# EAGLE schematic teensy_pedal (EAGLE 7.3.0)

## Sheet 1 of 2
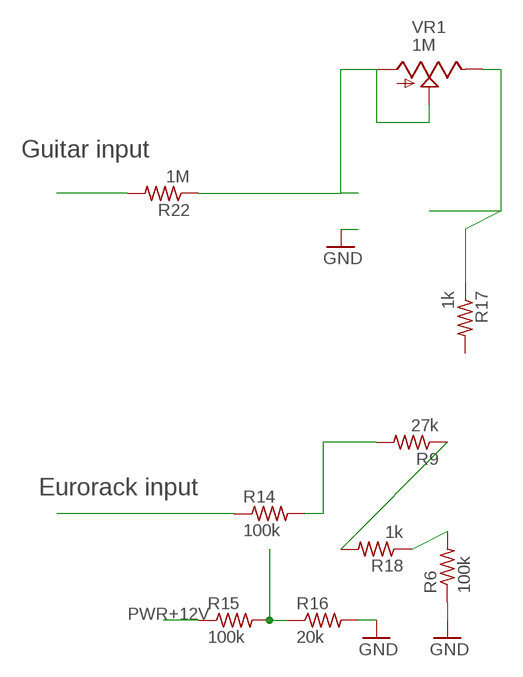
[diagram p0: schematic, sheet 1, part 1 of 3]
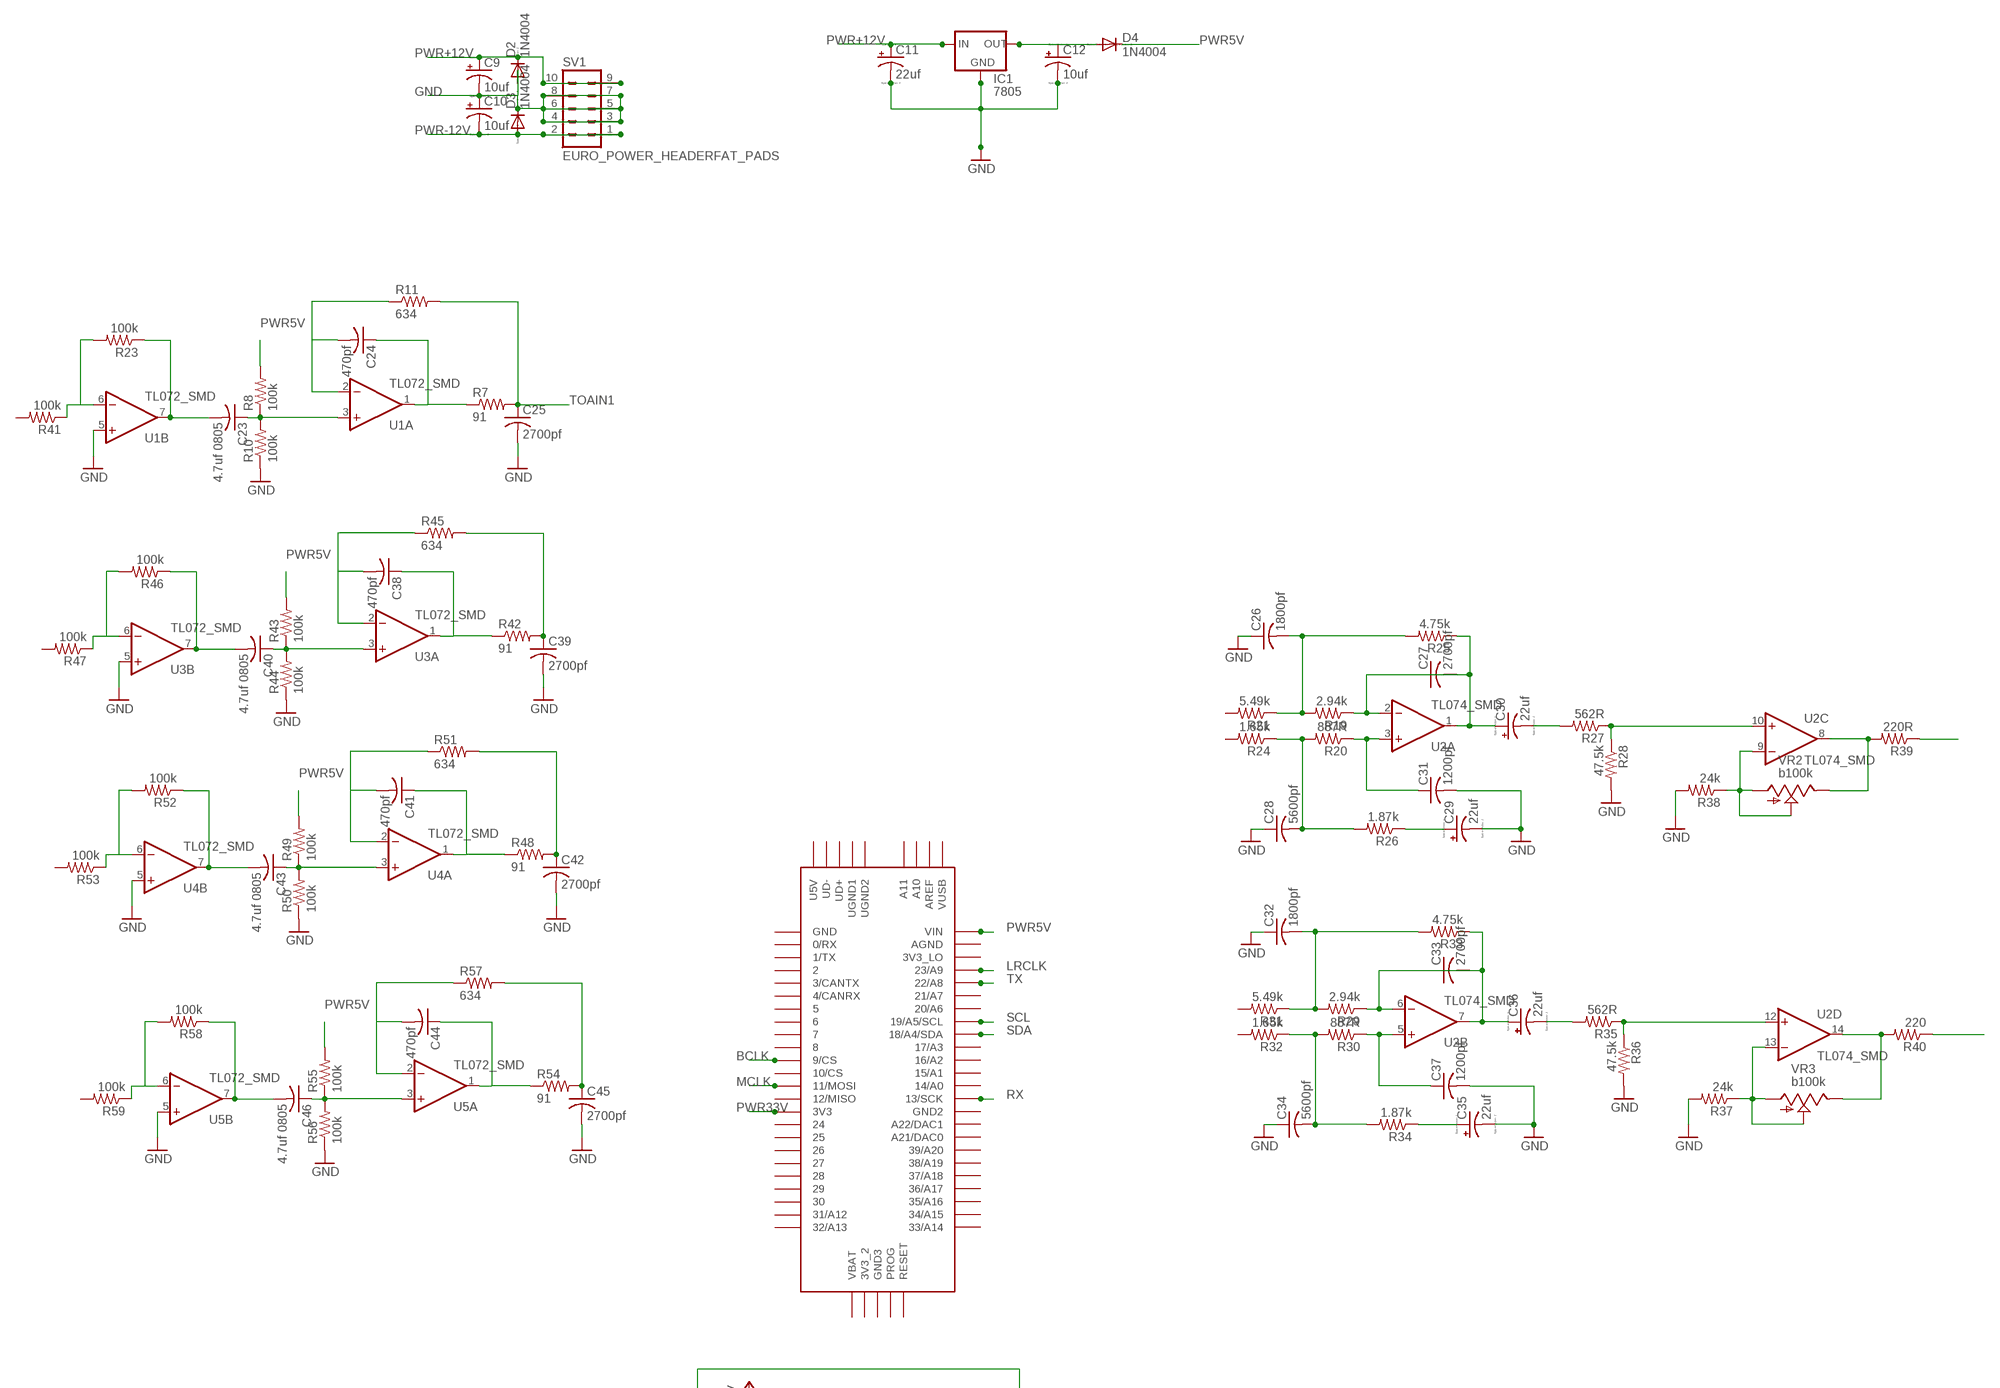
[diagram p1: schematic, sheet 1, part 2 of 3]
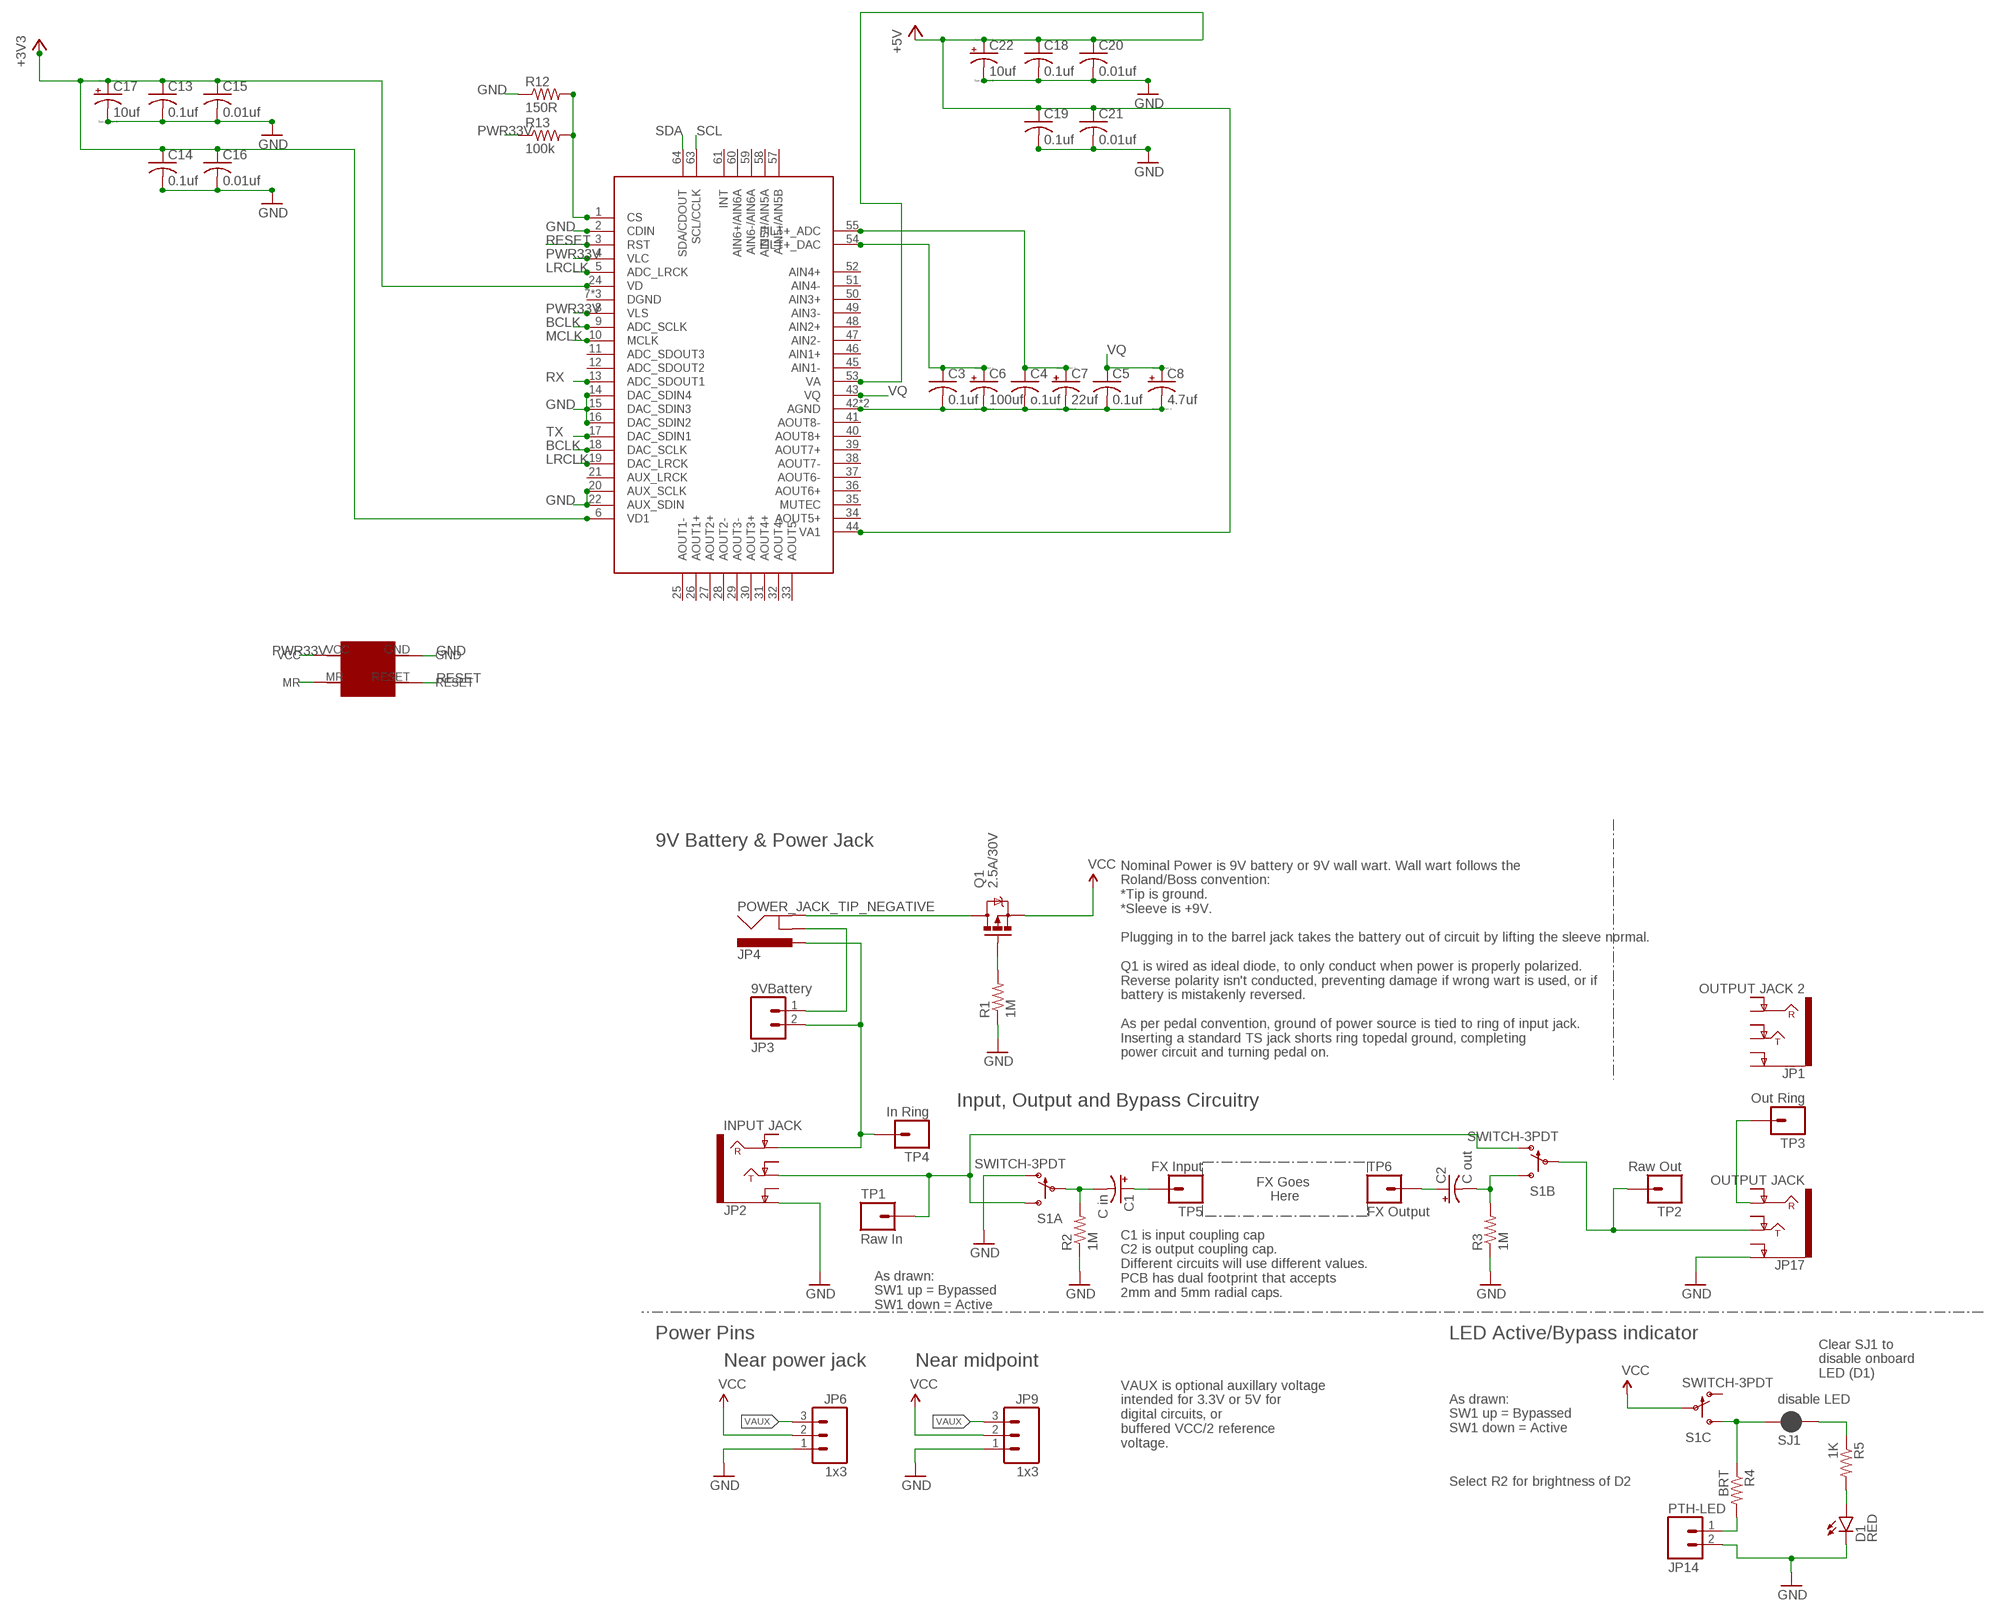
[diagram p2: schematic, sheet 1, part 3 of 3]

### Parts
C1  C in  DUAL_FOOTPRINT_CAP  [DUAL-CAP]
C2  C out  DUAL_FOOTPRINT_CAP  [DUAL-CAP]
C3  0.1uf  C-USC0603  [C0603]
C4  o.1uf  C-USC0603  [C0603]
C5  0.1uf  C-USC0603  [C0603]
C6  100uf  CPOL-US153CLV-0810  [153CLV-0810]
C7  22uf  CPOL-US153CLV-0605  [153CLV-0605]
C8  4.7uf  CPOL-US153CLV-0505  [153CLV-0505]
C9  10uf  CPOL-US153CLV-0505  [153CLV-0505]
C10  10uf  CPOL-US153CLV-0505  [153CLV-0505]
C11  22uf  CPOL-US153CLV-0605  [153CLV-0605]
C12  10uf  CPOL-US153CLV-0505  [153CLV-0505]
C13  0.1uf  C-USC0603  [C0603]
C14  0.1uf  C-USC0603  [C0603]
C15  0.01uf  C-USC0603  [C0603]
C16  0.01uf  C-USC0603  [C0603]
C17  10uf  CPOL-US153CLV-0505  [153CLV-0505]
C18  0.1uf  C-USC0603  [C0603]
C19  0.1uf  C-USC0603  [C0603]
C20  0.01uf  C-USC0603  [C0603]
C21  0.01uf  C-USC0603  [C0603]
C22  10uf  CPOL-US153CLV-0505  [153CLV-0505]
C23  4.7uf 0805  C-USC0805  [C0805]
C24  470pf  C-USC0603  [C0603]
C25  2700pf  C-USC0603  [C0603]
C26  1800pf  C-USC0603  [C0603]
C27  2700pf  C-USC0603  [C0603]
C28  5600pf  C-USC0603  [C0603]
C29  22uf  CPOL-US153CLV-0605  [153CLV-0605]
C30  22uf  CPOL-US153CLV-0605  [153CLV-0605]
C31  1200pf  C-USC0603  [C0603]
C32  1800pf  C-USC0603  [C0603]
C33  2700pf  C-USC0603  [C0603]
C34  5600pf  C-USC0603  [C0603]
C35  22uf  CPOL-US153CLV-0605  [153CLV-0605]
C36  22uf  CPOL-US153CLV-0605  [153CLV-0605]
C37  1200pf  C-USC0603  [C0603]
C38  470pf  C-USC0603  [C0603]
C39  2700pf  C-USC0603  [C0603]
C40  4.7uf 0805  C-USC0805  [C0805]
C41  470pf  C-USC0603  [C0603]
C42  2700pf  C-USC0603  [C0603]
C43  4.7uf 0805  C-USC0805  [C0805]
C44  470pf  C-USC0603  [C0603]
C45  2700pf  C-USC0603  [C0603]
C46  4.7uf 0805  C-USC0805  [C0805]
D1  RED  LED-RED0603  [LED-0603]
D2  1N4004  [DO41-10]
D3  1N4004  [DO41-10]
D4  1N4004  [DO41-10]
IC1  7805  78XXS  [78XXS]
JP1  OUTPUT JACK 2  AUDIO-JACK4-.25-HORIZ-TRS  [AUDIO-JACK-.25-INCH-HORIZ-PTH]
JP2  INPUT JACK  AUDIO-JACK4-.25-HORIZ-TRS  [AUDIO-JACK-.25-INCH-HORIZ-PTH]
JP3  9VBattery  M02PTH3  [1X02_LONGPADS]
JP4  POWER_JACK_TIP_NEGATIVE  [POWER-BARRELJACK-PTH-LOCK-FIXED]
JP6  1x3  M031X03_NO_SILK  [1X03_NO_SILK]
JP9  1x3  M031X03_NO_SILK  [1X03_NO_SILK]
JP14  PTH-LED  M02PTH3  [1X02_LONGPADS]
JP17  OUTPUT JACK  AUDIO-JACK4-.25-HORIZ-TRS  [AUDIO-JACK-.25-INCH-HORIZ-PTH]
Q1  2.5A/30V  MOSFET-PCHANNELDMG2307L  [SOT23-3]
R1  1M  1MOHM-1/10W-1%(0603)  [0603-RES]
R2  1M  1MOHM-1/10W-1%(0603)  [0603-RES]
R3  1M  1MOHM-1/10W-1%(0603)  [0603-RES]
R4  BRT  RESISTORAXIAL-0.3  [AXIAL-0.3]
R5  1K  1KOHM-1/10W-1%(0603)  [0603-RES]
R6  100k  R-US_R0603  [R0603]
R7  91  R-US_R0603  [R0603]
R8  100k  R-US_R0603  [R0603]
R9  27k  R-US_R0603  [R0603]
R10  100k  R-US_R0603  [R0603]
R11  634  R-US_R0603  [R0603]
R12  150R  R-US_R0603  [R0603]
R13  100k  R-US_R0603  [R0603]
R14  100k  R-US_R0603  [R0603]
R15  100k  R-US_R0603  [R0603]
R16  20k  R-US_R0603  [R0603]
R17  1k  R-US_R0603  [R0603]
R18  1k  R-US_R0603  [R0603]
R19  2.94k  R-US_R0603  [R0603]
R20  887R  R-US_R0603  [R0603]
R21  5.49k  R-US_R0603  [R0603]
R22  1M  R-US_R0603  [R0603]
R23  100k  R-US_R0603  [R0603]
R24  1.65k  R-US_R0603  [R0603]
R25  4.75k  R-US_R0603  [R0603]
R26  1.87k  R-US_R0603  [R0603]
R27  562R  R-US_R0603  [R0603]
R28  47.5k  R-US_R0603  [R0603]
R29  2.94k  R-US_R0603  [R0603]
R30  887R  R-US_R0603  [R0603]
R31  5.49k  R-US_R0603  [R0603]
R32  1.65k  R-US_R0603  [R0603]
R33  4.75k  R-US_R0603  [R0603]
R34  1.87k  R-US_R0603  [R0603]
R35  562R  R-US_R0603  [R0603]
R36  47.5k  R-US_R0603  [R0603]
R37  24k  R-US_R0603  [R0603]
R38  24k  R-US_R0603  [R0603]
R39  220R  R-US_R0603  [R0603]
R40  220  R-US_R0603  [R0603]
R41  100k  R-US_R0603  [R0603]
R42  91  R-US_R0603  [R0603]
R43  100k  R-US_R0603  [R0603]
R44  100k  R-US_R0603  [R0603]
R45  634  R-US_R0603  [R0603]
R46  100k  R-US_R0603  [R0603]
R47  100k  R-US_R0603  [R0603]
R48  91  R-US_R0603  [R0603]
R49  100k  R-US_R0603  [R0603]
R50  100k  R-US_R0603  [R0603]
R51  634  R-US_R0603  [R0603]
R52  100k  R-US_R0603  [R0603]
R53  100k  R-US_R0603  [R0603]
R54  91  R-US_R0603  [R0603]
R55  100k  R-US_R0603  [R0603]
R56  100k  R-US_R0603  [R0603]
R57  634  R-US_R0603  [R0603]
R58  100k  R-US_R0603  [R0603]
R59  100k  R-US_R0603  [R0603]
S1  SWITCH-3PDT  [STOMP-SWITCH-3PDT]
SJ1  disable LED  JUMPER-PAD-2-NC_BY_PASTEFULL-BOX-SILK  [PAD-JUMPER-2-NC_BY_PASTE_YES_SILK_FULL_BOX]
SV1  EURO_POWER_HEADERFAT_PADS  [EURO_PWR_HEADER_FAT]
TP1  Raw In  M01PTH_NO_SILK_YES_STOP  [1X01_NO_SILK]
TP2  Raw Out  M01PTH_NO_SILK_YES_STOP  [1X01_NO_SILK]
TP3  Out Ring  M01PTH_NO_SILK_YES_STOP  [1X01_NO_SILK]
TP4  In Ring  M01PTH_NO_SILK_YES_STOP  [1X01_NO_SILK]
TP5  FX Input  M01PTH_NO_SILK_YES_STOP  [1X01_NO_SILK]
TP6  FX Output  M01PTH_NO_SILK_YES_STOP  [1X01_NO_SILK]
U1  TL072_SMD  [SO08]
U2  TL074_SMD  [SO14]
U3  TL072_SMD  [SO08]
U4  TL072_SMD  [SO08]
U5  TL072_SMD  [SO08]
U$1  CS42448  [LQFP64]
U$2  TEENSY_3.5/3.6  [TEENSY_3.5/3.6]
U$3  CAT811  [SOT-143]
VR1  1M  9MM_SNAP-IN_POT_  [9MM_SNAP-IN_POT]
VR2  b100k  9MM_SNAP-IN_POT_  [9MM_SNAP-IN_POT]
VR3  b100k  9MM_SNAP-IN_POT_  [9MM_SNAP-IN_POT]

### Nets
BCLK: U$1.9(ADC_SCLK) U$1.18(DAC_SCLK) U$2.9/CS
FX_IN: C1.P$2(-) C1.P$3(-) R2.2 S1.P$2(A:P)
FX_OUT: C2.P$2(-) C2.P$3(-) R3.2 S1.P$6(B:S)
GND: C9.- C10.+ C11.- C12.- C13.2 C14.2 C15.2 C16.2 C17.- C18.2 C19.2 C20.2 C21.2 C22.- C25.2 C26.1 C28.1 C29.- C31.2 C32.1 C34.1 C35.- C37.2 C39.2 C42.2 C45.2 D1.C D2.A D3.C IC1.GND JP2.SLEEVE(EARTH) JP6.1 JP9.1 JP14.2 JP17.SLEEVE(EARTH) R1.1 R2.1 R3.1 R6.1 R10.1 R12.1 R16.2 R28.2 R36.2 R37.2 R38.2 R44.1 R50.1 R56.1 S1.P$1(A:O) SV1.3 SV1.4 SV1.5 SV1.6 SV1.7 SV1.8 U1.5(B:+IN) U3.5(B:+IN) U4.5(B:+IN) U5.5(B:+IN) U$1.2(CDIN) U$1.14(DAC_SDIN4) U$1.15(DAC_SDIN3) U$1.16(DAC_SDIN2) U$1.20(AUX_SCLK) U$1.22(AUX_SDIN)
LEDA: JP14.1 R4.P$2
LRCLK: U$1.5(ADC_LRCK) U$1.19(DAC_LRCK) U$2.23/A9
MCLK: U$1.10(MCLK) U$2.11/MOSI
N$1: R12.2 R13.2 U$1.1(CS)
N$2: C3.2 C4.2 C5.2 C6.- C7.- C8.- U$1.42(AGND) U$1.56(AGND)
N$4: C4.1 C7.+ U$1.55(FILT+_ADC)
N$5: C3.1 C6.+ U$1.54(FILT+_DAC)
N$6: C24.1 R7.1 U1.1(A:OUT)
N$7: R17.1 VR1.3(E)
N$8: C12.+ D4.A IC1.OUT
N$9: C24.2 R11.1 U1.2(A:-IN)
N$10: C23.1 R8.1 R10.2 U1.3(A:+IN)
N$11: R37.1 U2.13(D:-IN) VR3.1(A) VR3.2(S)
N$12: R15.2 R16.1
N$13: R9.1 R18.2
N$14: R9.2 R14.2
N$15: R14.1
N$16: C30.- R27.2
N$17: R27.1 R28.1 U2.10(C:+IN)
N$18: C31.1 R20.1 U2.3(A:+IN)
N$19: R22.1 VR1.1(A) VR1.2(S)
N$20: C23.2 R23.1 U1.7(B:OUT)
N$21: R6.2 R18.1
N$22: R22.2
N$23: C27.1 C27.2 C30.+ R19.1 R25.1 U2.1(A:OUT) U2.2(A:-IN)
N$24: R38.1 U2.9(C:-IN) VR2.1(A) VR2.2(S)
N$25: D1.A R5.2
N$26: C28.2 R20.2 R24.1 R26.2
N$27: R40.2 U2.14(D:OUT) VR3.3(E)
N$28: C29.+ R26.1
N$29: R39.2 U2.8(C:OUT) VR2.3(E)
N$30: R39.1
N$31: C26.2 R19.2 R21.1 R25.2
N$32: C36.- R35.2
N$33: R35.1 R36.1 U2.12(D:+IN)
N$34: C37.1 R30.1 U2.5(B:+IN)
N$35: R4.P$1 S1.P$9(C:S) SJ1.1
N$36: C33.1 C33.2 C36.+ R29.1 R33.1 U2.6(B:-IN) U2.7(B:OUT)
N$37: C34.2 R30.2 R32.1 R34.2
N$38: C35.+ R34.1
N$39: C32.2 R29.2 R31.1 R33.2
N$40: R40.1
N$41: R23.2 R41.1 U1.6(B:-IN)
N$42: C38.1 R42.1 U3.1(A:OUT)
N$43: C38.2 R45.1 U3.2(A:-IN)
N$44: C40.1 R43.1 R44.2 U3.3(A:+IN)
N$45: JP3.1 JP4.SLEEVE-NORMAL(SLEEVEBREAK)
N$46: C40.2 R46.1 U3.7(B:OUT)
N$47: R46.2 R47.1 U3.6(B:-IN)
N$48: C41.1 R48.1 U4.1(A:OUT)
N$49: C41.2 R51.1 U4.2(A:-IN)
N$50: C43.1 R49.1 R50.2 U4.3(A:+IN)
N$51: C43.2 R52.1 U4.7(B:OUT)
N$52: R52.2 R53.1 U4.6(B:-IN)
N$53: C44.1 R54.1 U5.1(A:OUT)
N$54: C44.2 R57.1 U5.2(A:-IN)
N$55: JP2.RING JP3.2 JP4.TIP TP4.1
N$56: C46.1 R55.1 R56.2 U5.3(A:+IN)
N$57: C46.2 R58.1 U5.7(B:OUT)
N$58: R58.2 R59.1 U5.6(B:-IN)
N$65: R5.1 SJ1.2
N$66: JP17.RING TP3.1
N$67: C1.P$1(+) TP5.1
N$68: C2.P$1(+) TP6.1
N$70: JP2.TIP S1.P$3(A:S) S1.P$4(B:O) TP1.1
N$71: JP17.TIP S1.P$5(B:P) TP2.1
N$75: Q1.1(G) R1.2
PWR5V: C18.1 C19.1 C20.1 C21.1 C22.+ D4.C R8.2 R43.2 R49.2 R55.2 U$1.44(VA1) U$1.53(VA) U$2.VIN ; supply symbol labelled +5V
PWR33V: C13.1 C14.1 C15.1 C16.1 C17.+ R13.1 U$1.4(VLC) U$1.6(VD1) U$1.8(VLS) U$1.24(VD) U$2.3V3 ; supply symbol labelled +3V3
PWR+12V: C9.+ C11.+ D2.C IC1.IN R15.1 SV1.9 SV1.10
PWR-12V: C10.- D3.A SV1.1 SV1.2
RESET: U$1.3(RST)
RX: U$1.13(ADC_SDOUT1) U$2.13/SCK
SCL: U$1.63(SCL/CCLK) U$2.19/A5/SCL
SDA: U$1.64(SDA/CDOUT) U$2.18/A4/SDA
TOAIN1: C25.1 C42.1 R7.2 R11.2 R48.2 R51.2
TOAIN2: C39.1 R42.2 R45.2
TOAIN3: C45.1 R54.2 R57.2
TX: U$1.17(DAC_SDIN1) U$2.22/A8
VAUX: JP6.3 JP9.3
VBATT: JP4.SLEEVE Q1.3(D)
VCC: JP6.2 JP9.2 Q1.2(S) S1.P$8(C:P)
VQ: C5.1 C8.+ U$1.43(VQ)
Unconnected: JP1.RING JP1.RING-NORM JP1.SLEEVE(EARTH) JP1.SLEEVE-NORM(EARTH-NORM) JP1.TIP JP1.TIP-NORM JP2.RING-NORM JP2.SLEEVE-NORM(EARTH-NORM) JP2.TIP-NORM JP17.RING-NORM JP17.SLEEVE-NORM(EARTH-NORM) JP17.TIP-NORM R17.2 R21.2 R24.2 R31.2 R32.2 R41.2 R47.2 R53.2 R59.2 S1.P$7(C:O) U$1.11(ADC_SDOUT3) U$1.12(ADC_SDOUT2) U$1.21(AUX_LRCK) U$1.25(AOUT1-) U$1.26(AOUT1+) U$1.27(AOUT2+) U$1.28(AOUT2-) U$1.29(AOUT3-) U$1.30(AOUT3+) U$1.31(AOUT4+) U$1.32(AOUT4-) U$1.33(AOUT5-) U$1.34(AOUT5+) U$1.35(MUTEC) U$1.36(AOUT6+) U$1.37(AOUT6-) U$1.38(AOUT7-) U$1.39(AOUT7+) U$1.40(AOUT8+) U$1.41(AOUT8-) U$1.45(AIN1-) U$1.46(AIN1+) U$1.47(AIN2-) U$1.48(AIN2+) U$1.49(AIN3-) U$1.50(AIN3+) U$1.51(AIN4-) U$1.52(AIN4+) U$1.57(AIN5-/AIN5B) U$1.58(AIN5+/AIN5A) U$1.59(AIN6-/AIN6A) U$1.60(AIN6+/AIN6A) U$1.61(INT) U$2.0/RX U$2.1/TX U$2.2 U$2.3/CANTX U$2.3V3_2 U$2.3V3_LO U$2.4/CANRX U$2.5 U$2.6 U$2.7 U$2.8 U$2.10/CS U$2.12/MISO U$2.14/A0 U$2.15/A1 U$2.16/A2 U$2.17/A3 U$2.20/A6 U$2.21/A7 U$2.21/DAC0(A21/DAC0) U$2.24 U$2.25 U$2.26 U$2.27 U$2.28 U$2.29 U$2.30 U$2.31/A12 U$2.32/A13 U$2.33/A14 U$2.34/A15 U$2.35/A16 U$2.36/A17 U$2.37/A18 U$2.38/A19 U$2.39/A20 U$2.A10 U$2.A11 U$2.A22/DAC1 U$2.AGND U$2.AREF U$2.GND U$2.GND2 U$2.GND3 U$2.PROG U$2.RESET U$2.U5V U$2.UD+ U$2.UD- U$2.UGND1 U$2.UGND2 U$2.VBAT U$2.VUSB U$3.GND U$3.MR U$3.RESET U$3.VCC

### Notes on the sheet
- Guitar input
- Eurorack input
- 9V Battery & Power Jack
- Nominal Power is 9V battery or 9V wall wart. Wall wart follows the 
  Roland/Boss convention:
  *Tip is ground.
  *Sleeve is +9V.
  
  Plugging in to the barrel jack takes the battery out of circuit by lifting the sleeve normal.
  
  Q1 is wired as ideal diode, to only conduct when power is properly polarized.  
  Reverse polarity isn't conducted, preventing damage if wrong wart is used, or if 
  battery is mistakenly reversed.
  
  As per pedal convention, ground of power source is tied to ring of input jack.  
  Inserting a standard TS jack shorts ring topedal ground, completing 
  power circuit and turning pedal on.
- Input, Output and Bypass Circuitry
- FX Goes 
  Here
- C1 is input coupling cap
  C2 is output coupling cap.
  Different circuits will use different values.
  PCB has dual footprint that accepts 
  2mm and 5mm radial caps.
- As drawn:
  SW1 up = Bypassed
  SW1 down = Active
- Power Pins | LED Active/Bypass indicator
- Clear SJ1 to 
  disable onboard 
  LED (D1)
- Near power jack | Near midpoint
- VAUX is optional auxillary voltage
  intended for 3.3V or 5V for 
  digital circuits, or 
  buffered VCC/2 reference 
  voltage.
- As drawn:
  SW1 up = Bypassed
  SW1 down = Active
- Select R2 for brightness of D2

## Sheet 2 of 2

## Power pins joined to a net without a drawn wire
DGND: U$1.7(DGND) U$1.23(DGND) U$1.62(DGND)
V+: U1.8(P:V+) U2.4(P:V+) U3.8(P:V+) U4.8(P:V+) U5.8(P:V+)
V-: U1.4(P:V-) U2.11(P:V-) U3.4(P:V-) U4.4(P:V-) U5.4(P:V-)

## Library data of the parts
C1 C2 = Testing:DUAL_FOOTPRINT_CAP: Dual-footprint capacitor. Allows for population of PTH caps with 2mm or 5mm lead spacing. For times when you know you might need a coupling or bypass cap, but need flexibility for larger/smaller values.
C3-C5 C13-C16 C18-C21 C23-C28 C31-C34 C37-C46 = resistor:C-US: CAPACITOR, American symbol
C6-C12 C17 C22 C29 C30 C35 C36 = resistor:CPOL-US: POLARIZED CAPACITOR, American symbol
D1 = SparkFun-LED:LED-RED: Assorted Red LEDs LilyPad 1206- DIO-09912 1206- DIO-00809 0603- DIO-00819 "SMART" means more efficient and expensive; PROD_ID: DIO-00819
D2-D4 = diode:1N4004: DIODE general purpose rectifier, 1 A
IC1 = v-reg:78XXS: VOLTAGE REGULATOR
JP1 JP2 JP17 = SparkFun-Connectors:AUDIO-JACK4-.25-HORIZ-TRS: 1/4" TRS jack, horizontal Production SKU: COM-11144 Footprint unproven - datasheet and part seem to be slightly different; PROD_ID: CONN-12339; SF_ID: COM-11144
JP3 JP14 = SparkFun-Connectors:M02: Standard 2-pin 0.1" header. Use with - straight break away headers ( PRT-00116) - right angle break away headers (PRT-00553) - swiss pins (PRT-00743) - machine pins (PRT-00117) - female headers (PRT-00115) Molex polarized connector foot print use with: PRT-08233 with associated crimp pins and housings. 2.54_SCREWTERM for use with PRT-10571. 3.5mm Screw Terminal footprints for PRT-08084 5mm Screw Terminal footprints for use with PRT-08432
JP4 = Testing:POWER_JACK_TIP_NEGATIVE; PROD_ID: CONN-08197
JP6 JP9 = SparkFun-Connectors:M03: Header 3 Standard 3-pin 0.1" header. Use with straight break away headers (SKU : PRT-00116), right angle break away headers (PRT-00553), swiss pins (PRT-00743), machine pins (PRT-00117), and female headers (PRT-00115). Molex polarized connector foot print use with SKU : PRT-08232 with associated crimp pins and housings.
Q1 = SparkFun-DiscreteSemi:MOSFET-PCHANNEL: Generic PMOSFET IRLML2244 - TRANS-11153 (SOT-23 -20V -4.3A) (1.Gate 2.Source 3.Drain) FQP27P06 - COM-10349 <http://www.sparkfun.com/products/10349> (TO-220 -60V -27A) (1.Gate 2.Source 3.Drain); PROD_ID: TRANS-11308
R1-R3 = SparkFun-Resistors:1MOHM-1/10W-1%(0603): RES-07868; PROD_ID: RES-07868
R4 = SparkFun-Resistors:RESISTOR: Resistor Basic schematic elements and footprints for 0603, 1206, and PTH resistors.
R5 = SparkFun-Resistors:1KOHM-1/10W-1%(0603): RES-07856; PROD_ID: RES-07856
R6-R59 = resistor:R-US_: RESISTOR, American symbol
S1 = SparkFun-Electromechanical:SWITCH-3PDT: Three-pole, double-throw stomp switch. Drawn as three separate gates for schematic clarity.; PROD_ID: SWCH-13197
SJ1 = SparkFun-Passives:JUMPER-PAD-2-NC_BY_PASTE
SV1 = MusicThingModular:EURO_POWER_HEADER: Power Header 10 pin power header for Eurorack Power Supplies Variants with fatter pads for easier soldering, and the LOCK variant which has 5mil offset pins to hold the component in place before soldering
TP1-TP6 = SparkFun-Connectors:M01: Header 1 Standard 1-pin 0.1" header. Use with straight break away headers (SKU : PRT-00116), right angle break away headers (PRT-00553), swiss pins (PRT-00743), machine pins (PRT-00117), and female headers (PRT-00115). SMTSO-256-ET is a "flush mount" nut for a 4-40 screw. The older package used to be too tight, and did not allow it to sit properly thru the drill hit. The latest (0.165DIA) fits nice and snug.
U1 U3-U5 = MusicThingModular:TL072: Generic Dual Op Amp
U2 = MusicThingModular:TL074: Generic Quad Op Amp
U$1 = akm:CS42448
U$2 = Teensy356:TEENSY_3.5/3.6
U$3 = sot143:CAT811
VR1-VR3 = MusicThingModular:9MM_SNAP-IN_POT: 9mm vertical snap-in pot, Alpha / Panasonic style